# Altium schematic sheet Schematic.SchDoc
size Letter; SheetNumber: 1; SheetTotal: 1; SPICEModelCacheDOOVHHKG: <root> / <DocumentId>DOOVHHKG</DocumentId> / </root>
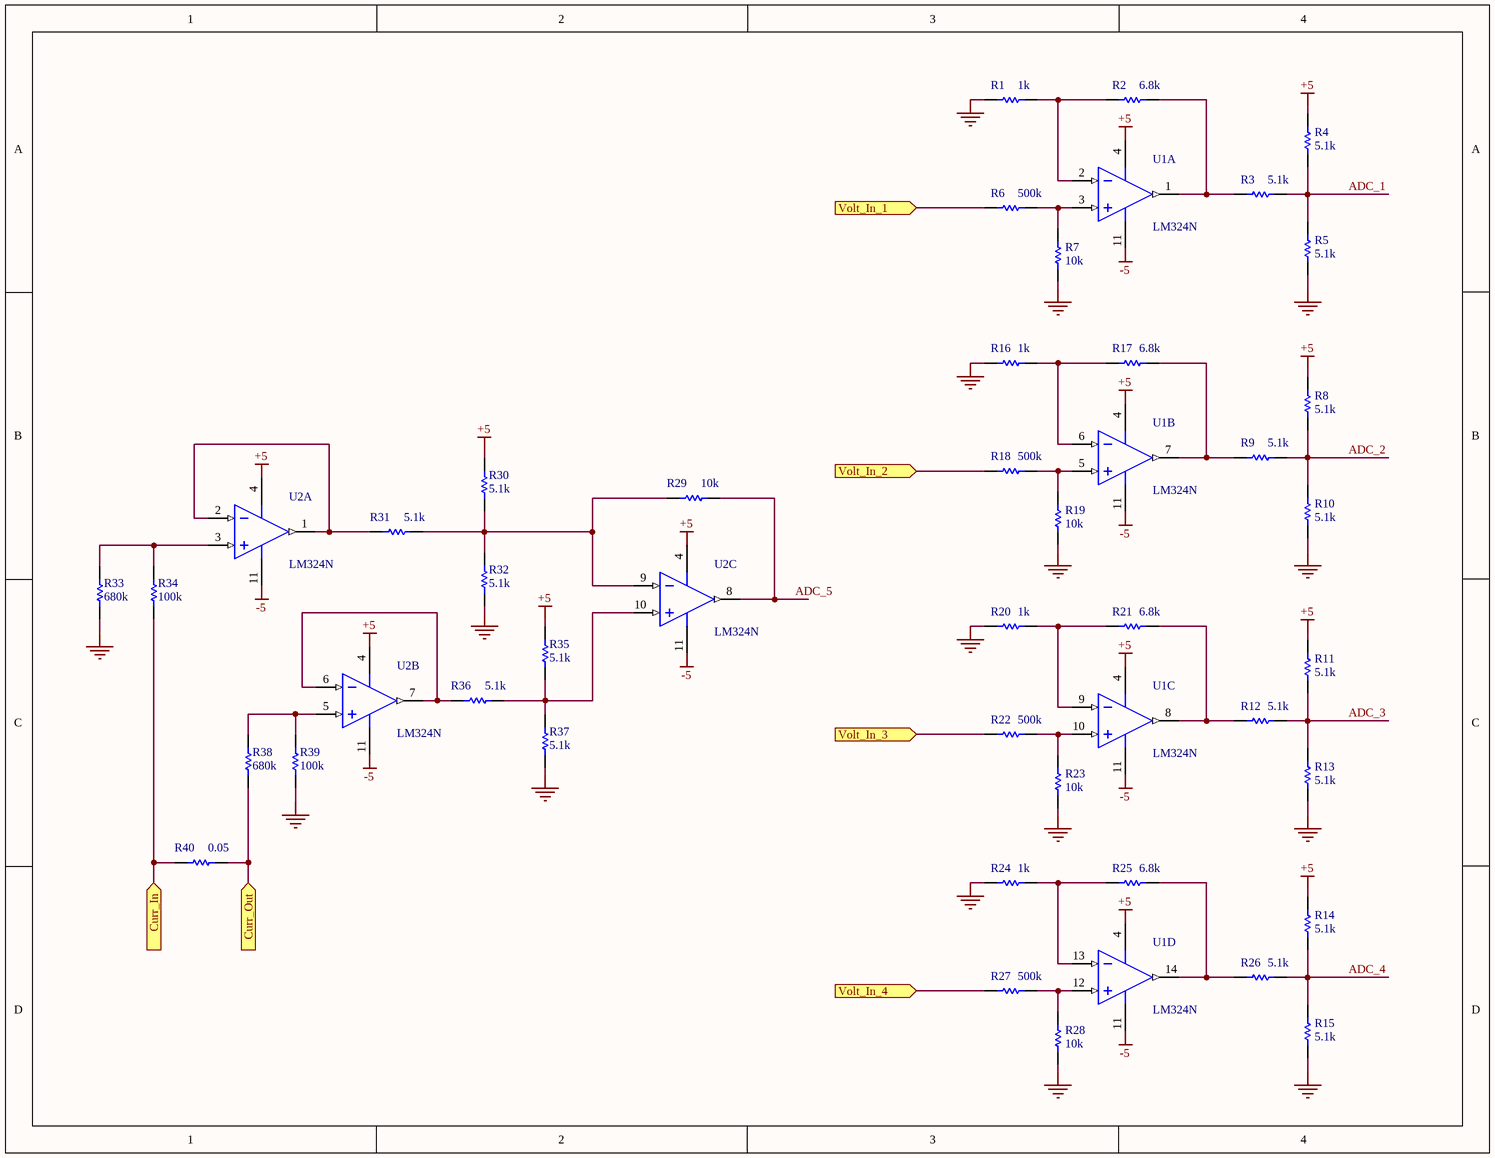
[diagram p0: Schematic.SchDoc]

## Parts
R1  value 1k  [AXIAL-0.3]
R2  value 6.8k  [AXIAL-0.3]
R3  value 5.1k  [AXIAL-0.3]
R4  value 5.1k  [AXIAL-0.3]
R5  value 5.1k  [AXIAL-0.3]
R6  value 500k  [AXIAL-0.3]
R7  value 10k  [AXIAL-0.3]
R8  value 5.1k  [AXIAL-0.3]
R9  value 5.1k  [AXIAL-0.3]
R10  value 5.1k  [AXIAL-0.3]
R11  value 5.1k  [AXIAL-0.3]
R12  value 5.1k  [AXIAL-0.3]
R13  value 5.1k  [AXIAL-0.3]
R14  value 5.1k  [AXIAL-0.3]
R15  value 5.1k  [AXIAL-0.3]
R16  value 1k  [AXIAL-0.3]
R17  value 6.8k  [AXIAL-0.3]
R18  value 500k  [AXIAL-0.3]
R19  value 10k  [AXIAL-0.3]
R20  value 1k  [AXIAL-0.3]
R21  value 6.8k  [AXIAL-0.3]
R22  value 500k  [AXIAL-0.3]
R23  value 10k  [AXIAL-0.3]
R24  value 1k  [AXIAL-0.3]
R25  value 6.8k  [AXIAL-0.3]
R26  value 5.1k  [AXIAL-0.3]
R27  value 500k  [AXIAL-0.3]
R28  value 10k  [AXIAL-0.3]
R29  value 10k  [AXIAL-0.3]
R30  value 5.1k  [AXIAL-0.3]
R31  value 5.1k  [AXIAL-0.3]
R32  value 5.1k  [AXIAL-0.3]
R33  value 680k  [AXIAL-0.3]
R34  value 100k  [AXIAL-0.3]
R35  value 5.1k  [AXIAL-0.3]
R36  value 5.1k  [AXIAL-0.3]
R37  value 5.1k  [AXIAL-0.3]
R38  value 680k  [AXIAL-0.3]
R39  value 100k  [AXIAL-0.3]
R40  value 0.05  [AXIAL-0.3]
U1  LM324N  [N0014A]  (parts A,B,C,D of 4)
U2  LM324N  [N0014A]  (parts A,B,C of 4)

## Ports
Curr_In (in), Curr_Out (in), Volt_In_1 (in), Volt_In_2 (in), Volt_In_3 (in), Volt_In_4 (in)

## Nets
+5: R4.2 R8.2 R11.2 R14.2 R30.2 R35.2 U1.4(V+) U2.4(V+)
-5: U1.11(GND) U2.11(GND)
GND: R1.1 R5.1 R7.1 R10.1 R13.1 R15.1 R16.1 R19.1 R20.1 R23.1 R24.1 R28.1 R32.1 R33.1 R37.1 R39.1
ADC_1: R3.2 R4.1 R5.2
ADC_2: R8.1 R9.2 R10.2
ADC_3: R11.1 R12.2 R13.2
ADC_4: R14.1 R15.2 R26.2
ADC_5: R29.1 U2.8(OUT3)
Curr_In: R34.1 R40.1 ; port Curr_In
Curr_Out: R38.1 R40.2 ; port Curr_Out
Volt_In_1: R6.1 ; port Volt_In_1
Volt_In_2: R18.1 ; port Volt_In_2
Volt_In_3: R22.1 ; port Volt_In_3
Volt_In_4: R27.1 ; port Volt_In_4
NetR1_2: R1.2 R2.1 U1.2(IN1-)
NetR2_2: R2.2 R3.1 U1.1(OUT1)
NetR6_2: R6.2 R7.2 U1.3(IN1+)
NetR9_1: R9.1 R17.2 U1.7(OUT2)
NetR12_1: R12.1 R21.2 U1.8(OUT3)
NetR16_2: R16.2 R17.1 U1.6(IN2-)
NetR18_2: R18.2 R19.2 U1.5(IN2+)
NetR20_2: R20.2 R21.1 U1.9(IN3-)
NetR22_2: R22.2 R23.2 U1.10(IN3+)
NetR24_2: R24.2 R25.1 U1.13(IN4-)
NetR25_2: R25.2 R26.1 U1.14(OUT4)
NetR27_2: R27.2 R28.2 U1.12(IN4+)
NetR29_2: R29.2 R30.1 R31.1 R32.2 U2.9(IN3-)
NetR31_2: R31.2 U2.1(OUT1) U2.2(IN1-)
NetR33_2: R33.2 R34.2 U2.3(IN1+)
NetR35_1: R35.1 R36.1 R37.2 U2.10(IN3+)
NetR36_2: R36.2 U2.6(IN2-) U2.7(OUT2)
NetR38_2: R38.2 R39.2 U2.5(IN2+)

## Library data of the parts
R1-R40 = Res1: Resistor; Published: 8-Jun-2000; LatestRevisionDate: 17-Jul-2002; LatestRevisionNote: Re-released for DXP Platform.; PackageReference: AXIAL-0.3; Publisher: Altium Limited; PackageDescription: Axial Device, Thru-Hole; 2 Leads; 0.3 in Pin Spacing
U1 U2 = CMP-0055-00082-3: Low Power Quad Operational Amplifier, 14-pin MDIP; Manufacturer: Texas Instruments; CompType: Amplifiers; PowerWise: N; PackageTopMarking: NSUZXYYTTE#*LM324N; PackageDescription: MDIP, .750 x .250 x.130in, 14 Lead, .100in Pitch; Package Reference: N0014A; RoHS: N; Code_JEDEC: MS-001-AA; ComponentLink1URL: http://www.ti.com/general/docs/lit/getliterature.tsp?genericPartNumber=LM324&fileType=pdf; ComponentLink1Description: Datasheet URL; PinCount: 14